# Altium schematic sheet merci_main.SchDoc
size A4; SheetNumber: 1; SheetTotal: 2
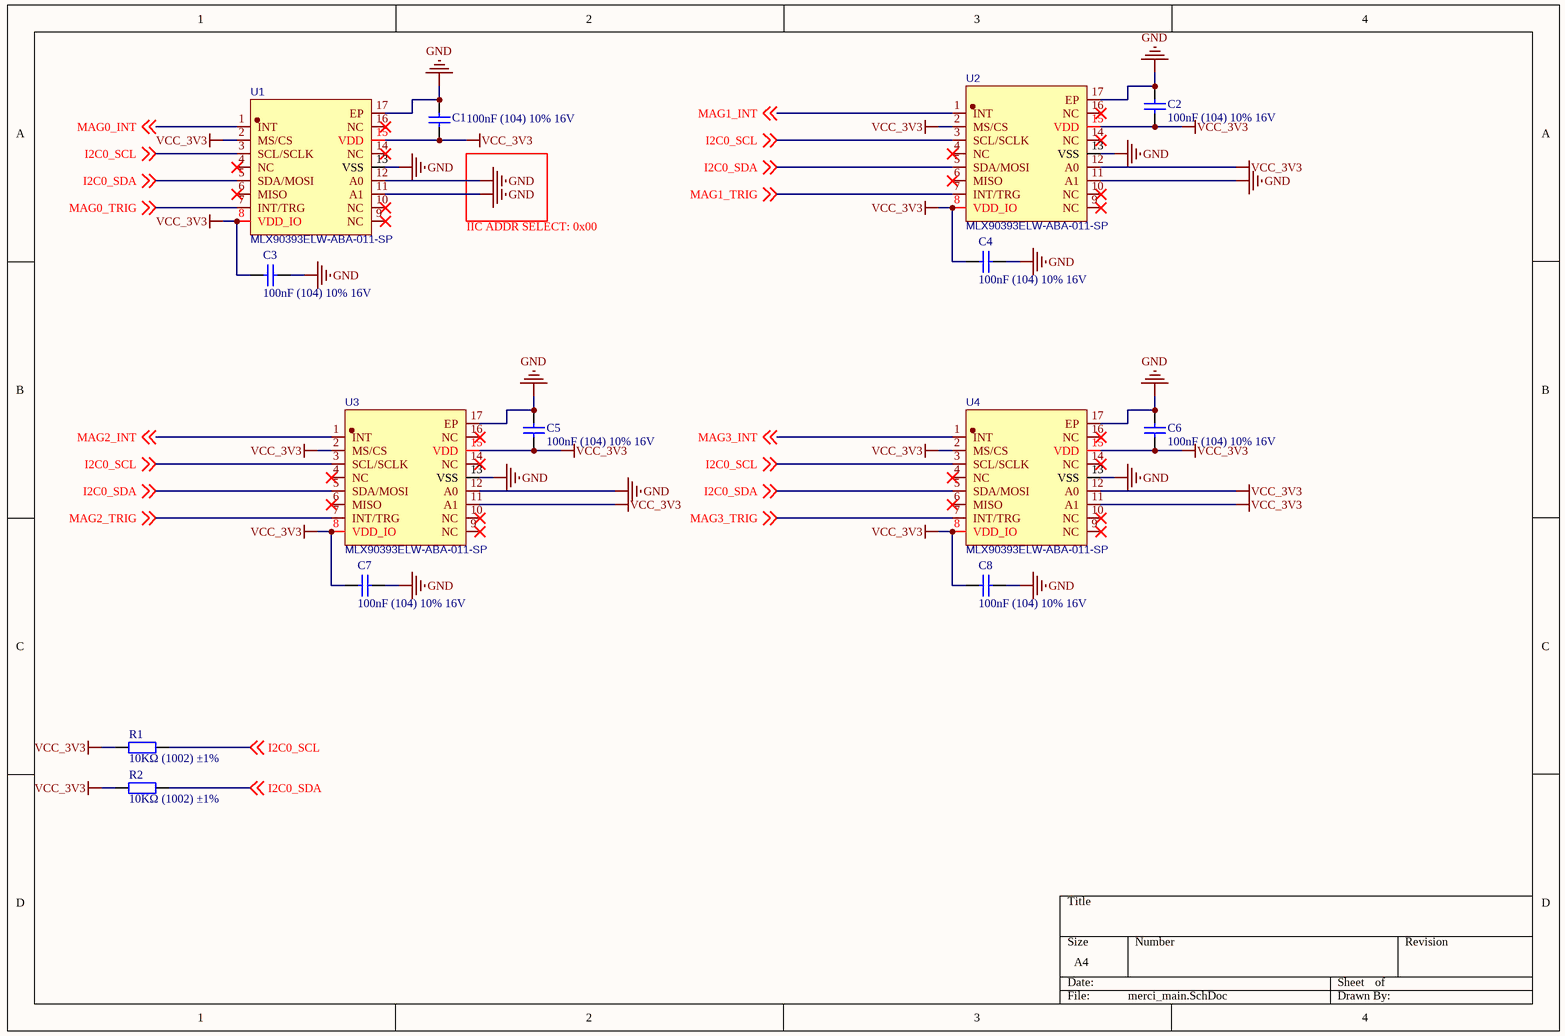
[diagram p0: merci_main.SchDoc]

## Parts
C1  100nF (104) 10% 16V  [LC-0402_C_NOSILK]
C2  100nF (104) 10% 16V  [LC-0402_C_NOSILK]
C3  100nF (104) 10% 16V  [LC-0402_C_NOSILK]
C4  100nF (104) 10% 16V  [LC-0402_C_NOSILK]
C5  100nF (104) 10% 16V  [LC-0402_C_NOSILK]
C6  100nF (104) 10% 16V  [LC-0402_C_NOSILK]
C7  100nF (104) 10% 16V  [LC-0402_C_NOSILK]
C8  100nF (104) 10% 16V  [LC-0402_C_NOSILK]
R1  10KΩ (1002) ±1%  [LC-0402_R_NOSILK]
R2  10KΩ (1002) ±1%  [LC-0402_R_NOSILK]
U1  MLX90393ELW-ABA-011-SP  [QFN-16_L3.0-W3.0-P0.50-TR-EP1.7]
U2  MLX90393ELW-ABA-011-SP  [QFN-16_L3.0-W3.0-P0.50-TR-EP1.7]
U3  MLX90393ELW-ABA-011-SP  [QFN-16_L3.0-W3.0-P0.50-TR-EP1.7]
U4  MLX90393ELW-ABA-011-SP  [QFN-16_L3.0-W3.0-P0.50-TR-EP1.7]

## Nets
GND: C1.2 C2.1 C3.1 C4.1 C5.2 C6.1 C7.1 C8.1 U1.11(A1) U1.12(A0) U1.13(VSS) U1.17(EP) U2.11(A1) U2.13(VSS) U2.17(EP) U3.12(A0) U3.13(VSS) U3.17(EP) U4.13(VSS) U4.17(EP)
VCC_3V3: C1.1 C2.2 C3.2 C4.2 C5.1 C6.2 C7.2 C8.2 R1.1 R2.1 U1.2(MS/CS) U1.8(VDD_IO) U1.15(VDD) U2.2(MS/CS) U2.8(VDD_IO) U2.12(A0) U2.15(VDD) U3.2(MS/CS) U3.8(VDD_IO) U3.11(A1) U3.15(VDD) U4.2(MS/CS) U4.8(VDD_IO) U4.11(A1) U4.12(A0) U4.15(VDD)
I2C0_SCL: R1.2 U1.3(SCL/SCLK) U2.3(SCL/SCLK) U3.3(SCL/SCLK) U4.3(SCL/SCLK) ; off-sheet I2C0_SCL
I2C0_SDA: R2.2 U1.5(SDA/MOSI) U2.5(SDA/MOSI) U3.5(SDA/MOSI) U4.5(SDA/MOSI) ; off-sheet I2C0_SDA
MAG0_INT: U1.1(INT) ; off-sheet MAG0_INT
MAG0_TRIG: U1.7(INT/TRG) ; off-sheet MAG0_TRIG
MAG1_INT: U2.1(INT) ; off-sheet MAG1_INT
MAG1_TRIG: U2.7(INT/TRG) ; off-sheet MAG1_TRIG
MAG2_INT: U3.1(INT) ; off-sheet MAG2_INT
MAG2_TRIG: U3.7(INT/TRG) ; off-sheet MAG2_TRIG
MAG3_INT: U4.1(INT) ; off-sheet MAG3_INT
MAG3_TRIG: U4.7(INT/TRG) ; off-sheet MAG3_TRIG

Not connected (* = marked no-connect by the designer): U1 4(NC)* 6(MISO)* 9(NC)* 10(NC)* 14(NC)* 16(NC)*; U2 4(NC)* 6(MISO)* 9(NC)* 10(NC)* 14(NC)* 16(NC)*; U3 4(NC)* 6(MISO)* 9(NC)* 10(NC)* 14(NC)* 16(NC)*; U4 4(NC)* 6(MISO)* 9(NC)* 10(NC)* 14(NC)* 16(NC)*

## Notes on the sheet
- IIC ADDR SELECT: 0x00

## Library data of the parts
C1-C8 = 0402 100nF (104) 10% 16V: 贴片电容; ComponentLink1Description: 供应商链接; ComponentLink1URL: http://www.szlcsc.com/product/details_1877.html; Package: 0402; Supplier: LC; SuppliersPartNumber: C1525
R1 R2 = 0402 10KΩ (1002) 1%: 贴片电阻; ComponentLink1Description: 供应商链接; ComponentLink1URL: http://www.szlcsc.com/product/details_26487.html; Package: 0402; Supplier: LC; SuppliersPartNumber: C25744
U1-U4 = MLX90393ELW-ABA-011-SP: BOM_Manufacturer: Melexis(比利时迈来芯); Contributor: LCSC; BOM_Supplier: LCSC; BOM_Supplier Part: C1526586; BOM_Manufacturer Part: MLX90393ELW-ABA-011-SP; BOM_JLCPCB Part Class: Extended Part; spicePre: U; spiceSymbolName: MLX90393ELW-ABA-011-SP